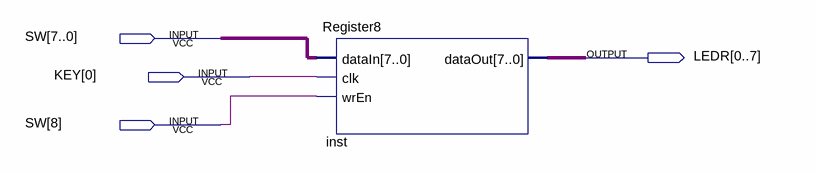
[diagram p0: schematic sheet]
// Quartus schematic Register_Demo.bdf as structural Verilog: 1 symbols, 4 pins
module Register_Demo (
  input  [8:0] SW,
  input  [0:0] KEY,
  output [0:7] LEDR
);

  Register8 inst (.dataIn(SW[7:0]), .clk(KEY[0]), .wrEn(SW[8]), .dataOut(LEDR));
endmodule
